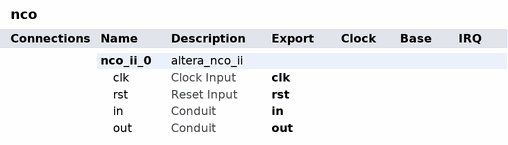
[diagram p0: system contents]
# Platform Designer (Qsys) system nco, Cyclone V 5CEBA4F23C8
# Parameters at their usual value, and those the tool derives, are not listed.
package require -exact qsys 17.1
create_system nco
set_project_property DEVICE_FAMILY {Cyclone V}
set_project_property DEVICE 5CEBA4F23C8

add_instance nco_ii_0 altera_nco_ii 17.1
set_instance_property nco_ii_0 AUTO_EXPORT true
set_instance_parameter_value nco_ii_0 apr 32
set_instance_parameter_value nco_ii_0 apri 16
set_instance_parameter_value nco_ii_0 arch small_rom
set_instance_parameter_value nco_ii_0 freq_out 0.001
set_instance_parameter_value nco_ii_0 fsamp 20.46
set_instance_parameter_value nco_ii_0 mpr 12
set_instance_parameter_value nco_ii_0 selected_device_family {Cyclone V}
set_instance_parameter_value nco_ii_0 want_sin_and_cos dual_output

# exported interfaces
add_interface clk clock sink
set_interface_property clk EXPORT_OF nco_ii_0.clk
add_interface in conduit end
set_interface_property in EXPORT_OF nco_ii_0.in
add_interface out conduit end
set_interface_property out EXPORT_OF nco_ii_0.out
add_interface rst reset sink
set_interface_property rst EXPORT_OF nco_ii_0.rst

set_interconnect_requirement {$system} qsys_mm.clockCrossingAdapter HANDSHAKE
set_interconnect_requirement {$system} qsys_mm.enableEccProtection FALSE
set_interconnect_requirement {$system} qsys_mm.insertDefaultSlave FALSE
set_interconnect_requirement {$system} qsys_mm.maxAdditionalLatency 1

save_system nco.qsys
